# Altium schematic sheet DIOT_Connectors.SchDoc: HVPSU_ISOL
size 420 x 297 mm; Project: HVPSU_ISOL.PrjPCB; Author: G.Kasprowicz; CompanyName: WUT ISE; DrawnBy: G.Kasprowicz; Organization: WUT ISE; Address1: PW ISE; Address2: Nowowiejska 15/19 00-665 Warsaw; Address3: gkasprow@gmail.com; Revision: 1; SheetNumber: -; SheetTotal: -; ModifiedBy: -; CheckedDate: -; Title2: DIOT Connectors; DivGrp: WUT ISE; Designer: G.Kasprowicz; ModifiedDate: -; ProjectName: Sensor Box
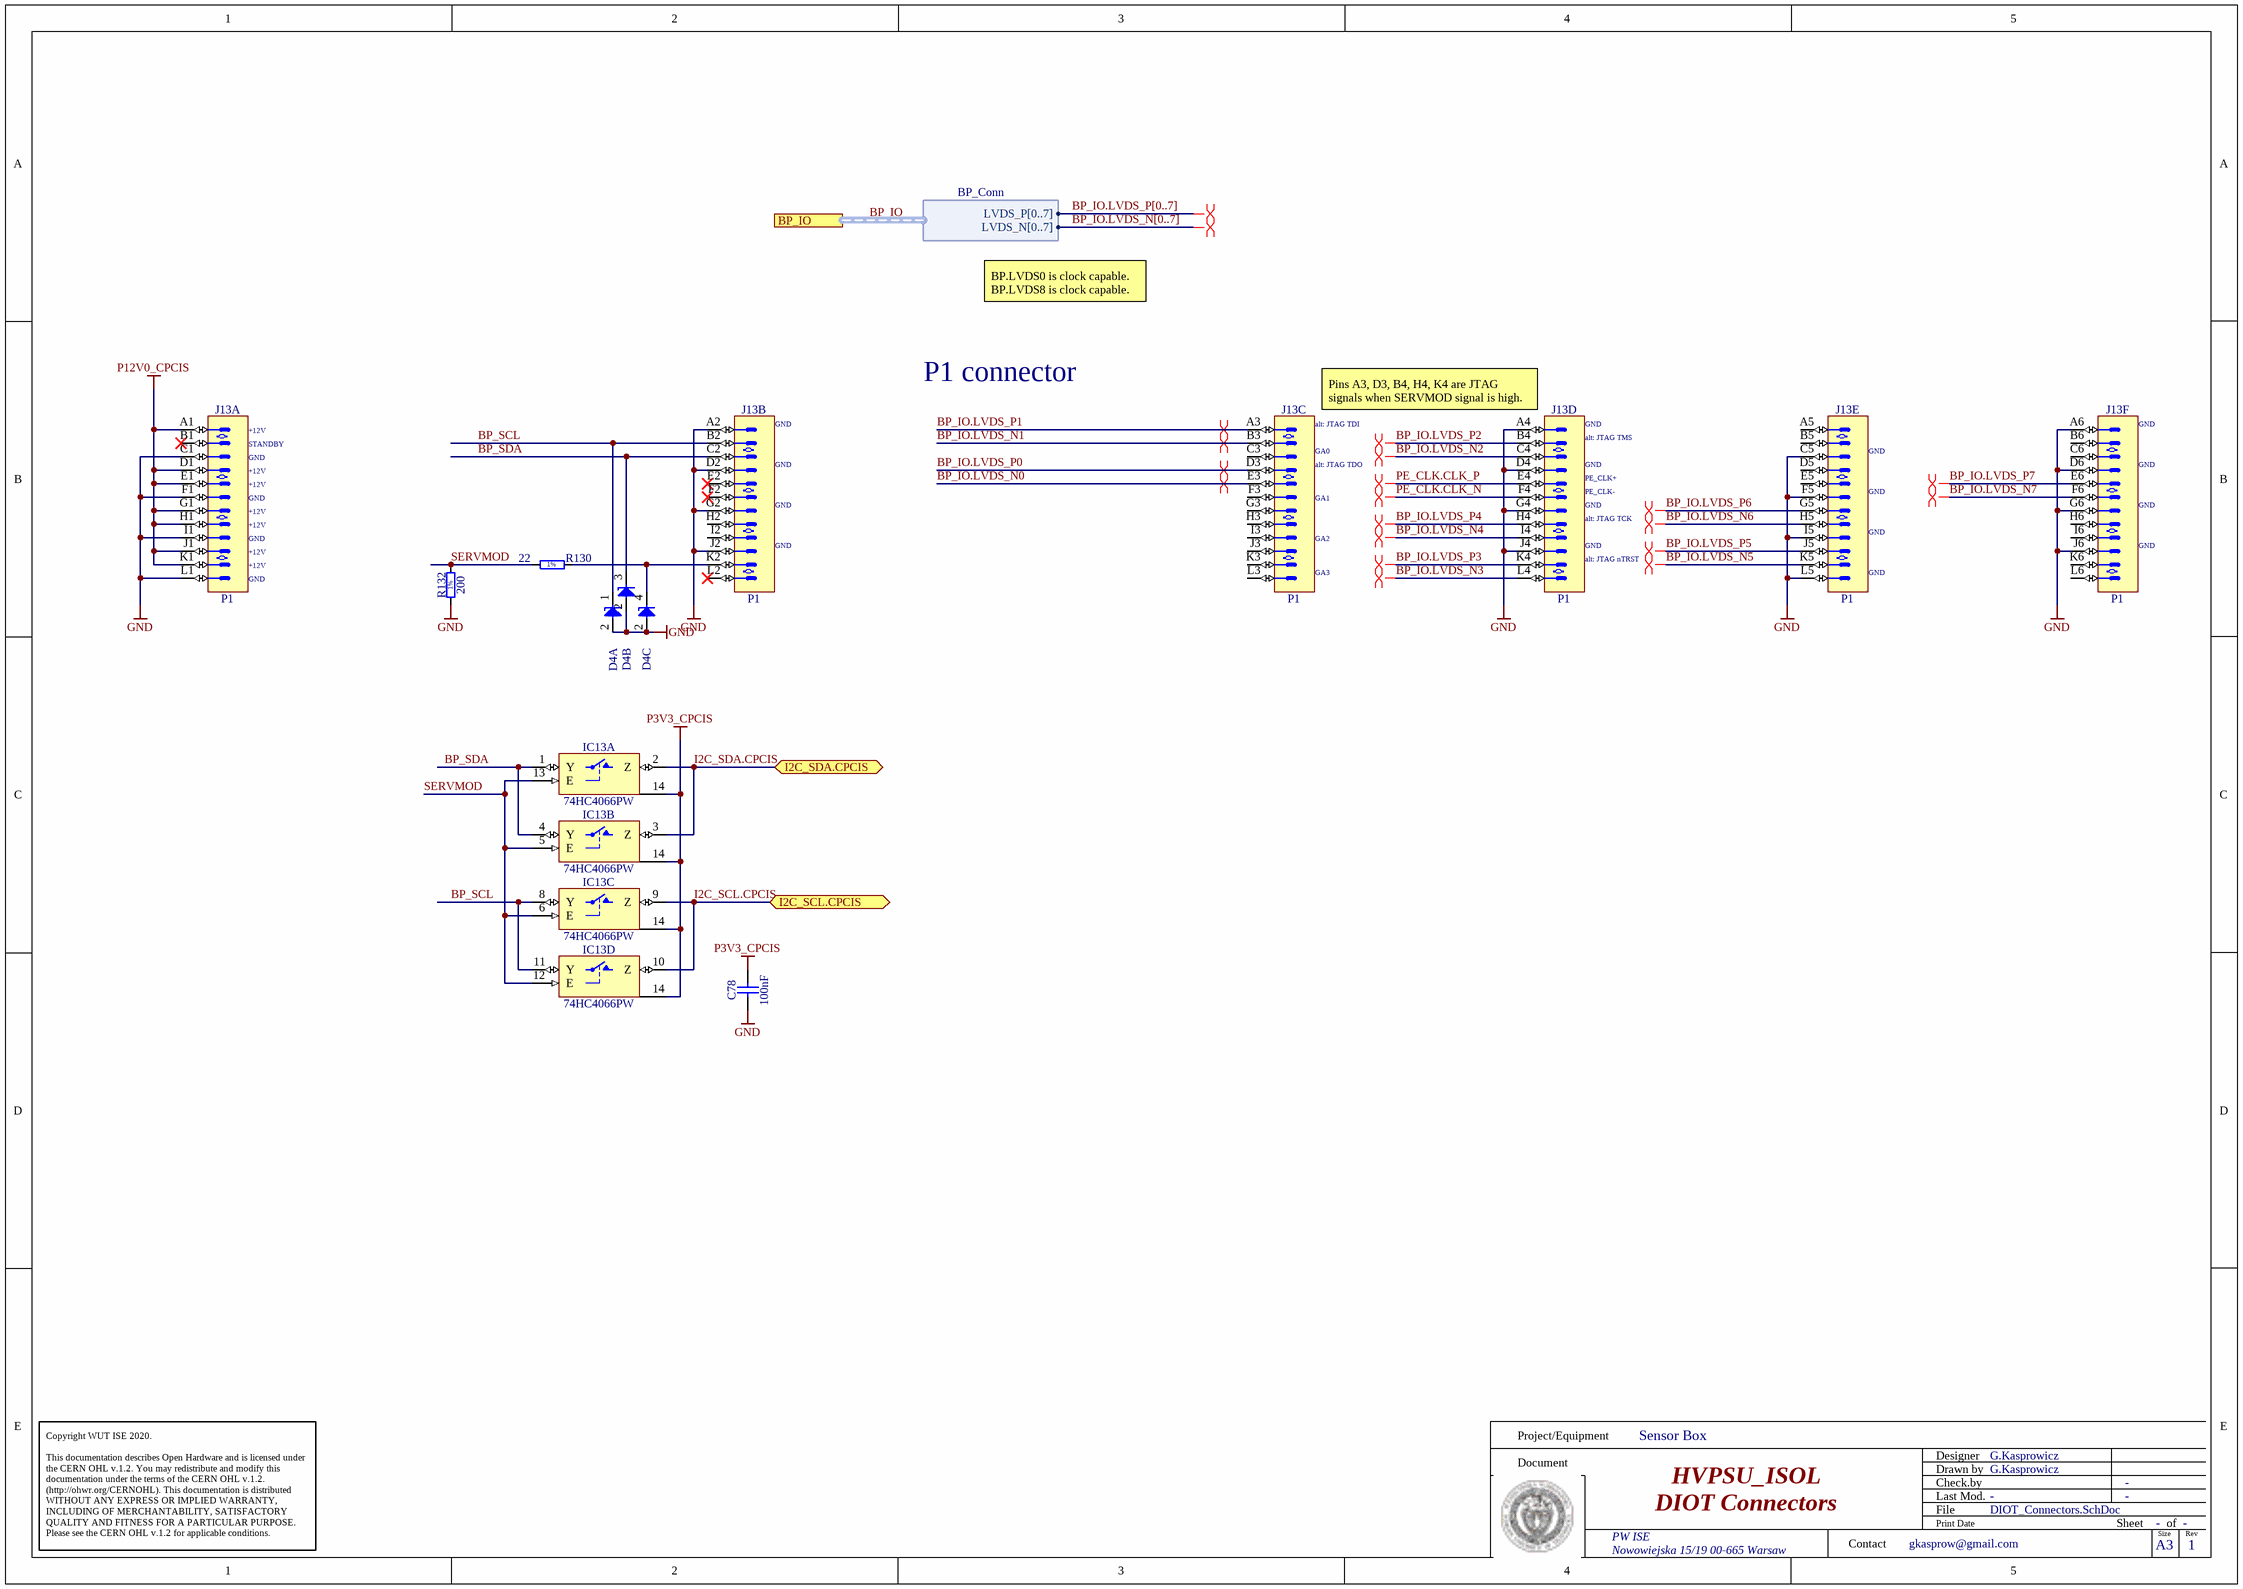
[diagram p0: DIOT_Connectors.SchDoc]

## Parts
C78  100nF  [CAPC1005X55N]
D4  PESD3V3L5UY  [SOT65P210X110-6N]  (value not drawn)  (parts A,B,C of 5)
IC13  74HC4066PW  [SOP65P640X110-14N]  (parts A,B,C,D of 4)
J13  P1  [AMPHENOL_10052825-101LF]  (parts A,B,C,D,E,F of 6)
R130  22  [RESC1005X40N]
R132  200  [RESC1005X40N]

## Ports
BP_IO (harness BP_Conn), I2C_SCL.CPCIS (bidir), I2C_SDA.CPCIS (bidir)

## Harnesses
BP_Conn: LVDS_P[0..7], LVDS_N[0..7]

## Nets
GND: C78.1 D4.2(A) IC13.7(GND) J13.A2 J13.A4 J13.A6 J13.C1 J13.C5 J13.D2 J13.D4 J13.D6 J13.F1 J13.F5 J13.G2 J13.G4 J13.G6 J13.I1 J13.I5 J13.J2 J13.J4 J13.J6 J13.L1 J13.L5 R132.1
P3V3_CPCIS: C78.2 IC13.14(VCC)
P12V0_CPCIS: J13.A1 J13.D1 J13.E1 J13.G1 J13.H1 J13.J1 J13.K1
BP_IO.LVDS_N0: J13.E3
BP_IO.LVDS_N1: J13.B3
BP_IO.LVDS_N2: J13.C4
BP_IO.LVDS_N3: J13.L4
BP_IO.LVDS_N4: J13.I4
BP_IO.LVDS_N5: J13.K5
BP_IO.LVDS_N6: J13.H5
BP_IO.LVDS_N7: J13.F6
BP_IO.LVDS_P0: J13.D3
BP_IO.LVDS_P1: J13.A3
BP_IO.LVDS_P2: J13.B4
BP_IO.LVDS_P3: J13.K4
BP_IO.LVDS_P4: J13.H4
BP_IO.LVDS_P5: J13.J5
BP_IO.LVDS_P6: J13.G5
BP_IO.LVDS_P7: J13.E6
BP_SCL: D4.1(C) IC13.8(Y) IC13.11(Y) J13.B2
BP_SDA: D4.3(C) IC13.1(Y) IC13.4(Y) J13.C2
I2C_SCL.CPCIS: IC13.9(Z) IC13.10(Z) ; port I2C_SCL.CPCIS
I2C_SDA.CPCIS: IC13.2(Z) IC13.3(Z) ; port I2C_SDA.CPCIS
PE_CLK.CLK_N: J13.F4
PE_CLK.CLK_P: J13.E4
SERVMOD: IC13.5(E) IC13.6(E) IC13.12(E) IC13.13(E) R130.1 R132.2
NetD4_4: D4.4(C) J13.K2 R130.2

Not connected (* = marked no-connect by the designer): J13 A5 B1* B5 B6 C3 C6 D5 E2* E5 F2* F3 G3 H2 H3 H6 I2 I3 I6 J3 K3 K6 L2* L3 L6

## Buses and harness runs
bus BP_IO.LVDS_N[0..7]
bus BP_IO.LVDS_P[0..7]
harness BP_IO = port BP_IO

## Layout directives
differential pair: (no net found under the mark), BP_IO.LVDS_N0, BP_IO.LVDS_N1, BP_IO.LVDS_N2, BP_IO.LVDS_N3, BP_IO.LVDS_N4, BP_IO.LVDS_N5, BP_IO.LVDS_N6, BP_IO.LVDS_N7, BP_IO.LVDS_P0, BP_IO.LVDS_P1, BP_IO.LVDS_P2, BP_IO.LVDS_P3, BP_IO.LVDS_P4, BP_IO.LVDS_P5, BP_IO.LVDS_P6, BP_IO.LVDS_P7, PE_CLK.CLK_N, PE_CLK.CLK_P

## Notes on the sheet
- BP.LVDS0 is clock capable.
  BP.LVDS8 is clock capable.
- P1 connector
- (near J13) +12V
- (near J13) STANDBY
- (near J13) GND
- (near J13) alt: JTAG TDI
- (near J13) GA0
- (near J13) Pins A3, D3, B4, H4, K4 are JTAG signals when SERVMOD signal is high.
- (near J13) alt: JTAG TMS
- (near J13) alt: JTAG TDO
- (near J13) GA1
- (near J13) alt: JTAG TCK
- (near J13) PE_CLK+
- (near J13) PE_CLK-
- (near J13) GA2
- (near J13) GA3
- (near J13) alt: JTAG nTRST
- Project/Equipment
- Document
- Designer
- Drawn by
- Check.by
- Copyright WUT ISE 2020.
  This documentation describes Open Hardware and is licensed under the CERN OHL v.1.2. You may redistribute and modify this documentation under the terms of the CERN OHL v.1.2. (http://ohwr.org/CERNOHL). This documentation is distributed WITHOUT ANY EXPRESS OR IMPLIED WARRANTY, INCLUDING OF MERCHANTABILITY, SATISFACTORY QUALITY AND FITNESS FOR A PARTICULAR PURPOSE. Please see the CERN OHL v.1.2 for applicable conditions.
- Contact
- File
- Last Mod.
- Print Date
- Sheet
- Size
- A3
- of
- Rev
- (in symbol R0402_22R_1%_0.0625W_100PPM) 1%
- (in symbol R0402_200R_1%_0.0625W_100PPM) 1%

## Library data of the parts
C78 = CC0402_100NF_16V_10%_X5R: Non-polarised capacitor; Part Description: SMD Multilayer Chip Ceramic Capacitor; Manufacturer: GENERIC; Manufacturer1 Part Number: GRM155R61C104KA88D; Voltage: 16V; TC: X5R; Tolerance: ±10%; Part Number: CC0402_100NF_16V_10%_X5R; Component Kind: Standard; Component Type: Standard; Pin Count: 2; Value: 100nF; Status: None; Manufacturer Part Number: CC0402_100NF_16V_10%_X5R; Case: 0402; Mounted: Yes; Socket: No; SMD: Yes; Sense: No; Manufacturer1 Example: MURATA; Manufacturer1 ComponentHeight: 0.55mm; HelpURL: \\cern.ch\dfs\Applications\Altium\Datasheets\CC0402_X5R_MURATA_GRM.pdf; Author: CERN DEM JLC; CreateDate: 10.12.2013; LatestRevisionDate: 10.12.2013
D4 = PESD3V3L5UY: Fivefold ESD Protection Diode Arrays; Part Description: Fivefold ESD Protection Diode Arrays (30kV); Manufacturer: NEXPERIA; Voltage: 3.3V; Power: 200W; PressFit: No; Bonding: No; Part Number: PESD3V3L5UY; Component Kind: Standard; Component Type: Standard; Device: PESD3V3L5UY; PackageDescription: SOT363, SC-88, 0.65mm Pitch; 6 Pin, 1.25mm W X 2.00mm L X 1.10mm H body, IPC Medium Density; Manufacturer Part Number: PESD3V3L5UY; Pin Count: 6; Case: SOT363; Mounted: Yes; Socket: No; SMD: Yes; Sense: No; ComponentHeight: 1.1mm; HelpURL: \\cern.ch\dfs\Applications\Altium\Datasheets\PESD3V3L5UY.pdf; Author: CERN DEM WB; CreateDate: 05.07.2021; LatestRevisionDate: 05.07.2021
IC13 = 74HC4066PW: Part Description: Quad Single-Pole Single-Throw Analog Switch; Manufacturer: NXP SEMICONDUCTORS; PressFit: No; Bonding: No; Part Number: 74HC4066PW; Component Kind: Standard; Component Type: Standard; Device: 74HC4066PW; PackageDescription: SOP, 14-Leads, Body 4.4x5mm (max), Pitch 0.65mm, IPC Medium Density; Manufacturer Part Number: 74HC4066PW; Pin Count: 14; Case: TSSOP14; Mounted: Yes; Socket: No; SMD: Yes; Sense: No; ComponentHeight: 1.1mm; Author: CERN DEM JLC; HelpURL: \\cern.ch\dfs\Applications\Altium\Datasheets\74HC4066PW.pdf; CreateDate: 19.11.2014; LatestRevisionDate: 19.11.2014
J13 = AMPHENOL_10052825-101LF: 72 Contacts Header, 6 Columns, 4 Pairs per Column; Part Description: 72 Contacts, 2mm Pitch, 6 Columns, 4 Pairs per Column, 4 Walls, Right Angle Header; Part Number: AMPHENOL_10052825-101LF; Component Kind: Standard; Component Type: Standard; Pin Count: 72; Family: AirMax VS; Mounted: Yes; Socket: No; SMD: No; PressFit: Yes; Sense: No; Status: None; Manufacturer: AMPHENOL; Manufacturer Part Number: 10052825-101LF; ComponentHeight: 15.35mm; HelpURL: \\cern.ch\dfs\Applications\Altium\Datasheets\AMPHENOL_10052825-101LF.pdf; ComponentLink1URL: \\cern.ch\dfs\Applications\Altium\Datasheets\AMPHENOL_10052825-101LF_Application.pdf; ComponentLink1Description: Application; Author: CERN DEM MR; CreateDate: 19/02/2018; LatestRevisionDate: 19/02/2018; Classname: Overlapping
R130 = R0402_22R_1%_0.0625W_100PPM: Resistor - 1%; Part Description: General Purpose Thick Film Chip Resistor; Manufacturer: GENERIC; Manufacturer1 Part Number: 232270672209L; TC: ±100ppm/°C; PressFit: No; Part Number: R0402_22R_1%_0.0625W_100PPM; Component Kind: Standard; Component Type: Standard; Pin Count: 2; Value: 22; Status: Not Recommended; Power: 0.0625W; Tolerance: ±1%; Manufacturer Part Number: R0402_22R_1%_0.0625W_100PPM; Case: 0402; Mounted: Yes; Socket: No; SMD: Yes; Manufacturer1 Example: YAGEO PHYCOMP; Manufacturer1 ComponentHeight: 0.4mm; HelpURL: \\cern.ch\dfs\Applications\Altium\Datasheets\R0402_Phycomp_RC0402.pdf; Author: CERN DEM JLC; CreateDate: 03.12.2007; LatestRevisionDate: 17.10.2012; Sense: No
R132 = R0402_200R_1%_0.0625W_100PPM: Resistor - 1%; Part Description: General Purpose Thick Film Chip Resistor; Manufacturer: GENERIC; Manufacturer1 Part Number: 232270672001L; TC: ±100ppm/°C; PressFit: No; Part Number: R0402_200R_1%_0.0625W_100PPM; Component Kind: Standard; Component Type: Standard; Pin Count: 2; Value: 200; Status: Not Recommended; Power: 0.0625W; Tolerance: ±1%; Manufacturer Part Number: R0402_200R_1%_0.0625W_100PPM; Case: 0402; Mounted: Yes; Sense: No; Socket: No; SMD: Yes; Manufacturer1 Example: YAGEO PHYCOMP; Manufacturer1 ComponentHeight: 0.4mm; HelpURL: \\cern.ch\dfs\Applications\Altium\Datasheets\R0402_Phycomp_RC0402.pdf; Author: CERN DEM JLC; CreateDate: 2007-12-03; LatestRevisionDate: 2012-10-17